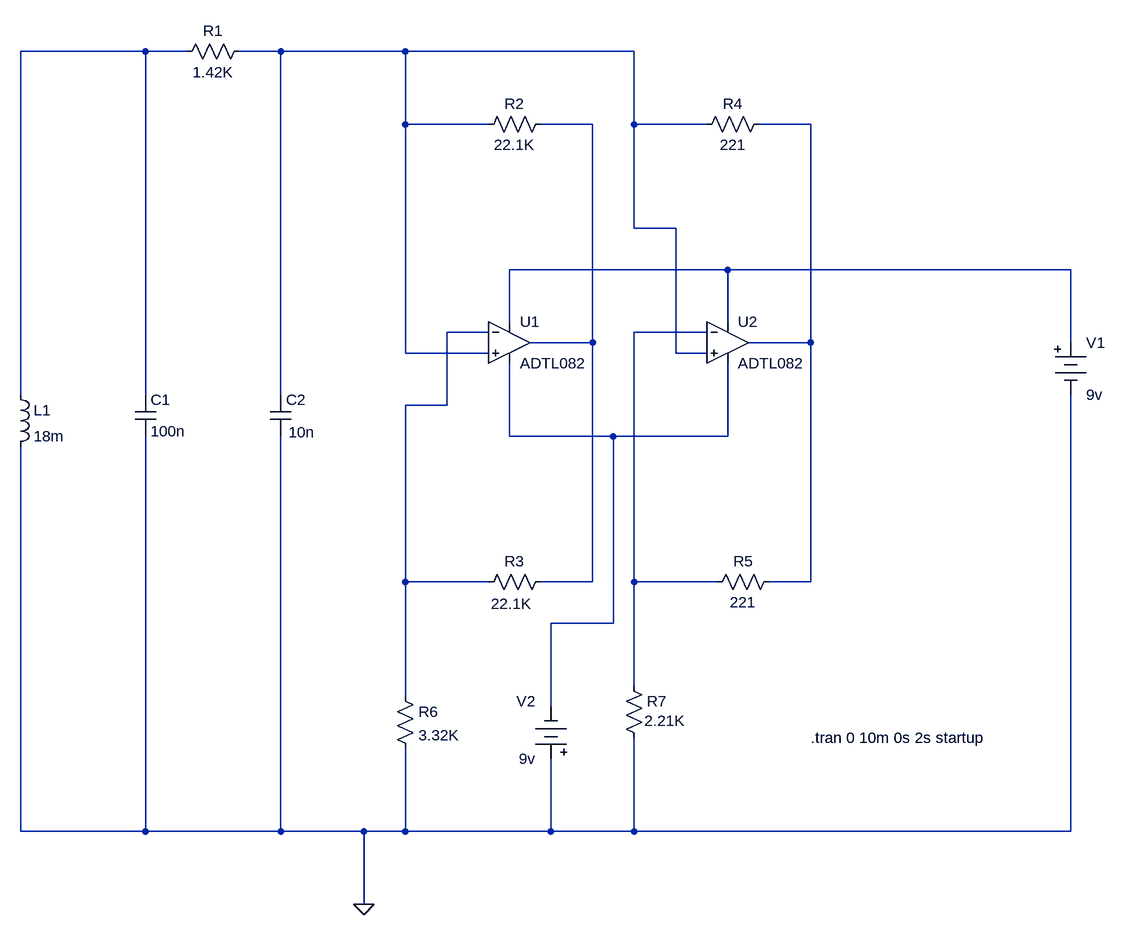
[diagram p0: schematic chuacomplete.asc]
chuacomplete.asc, the LTspice schematic file:
Version 4
SHEET 1 880 680
WIRE -2192 -2160 -2384 -2160
WIRE -2128 -2160 -2192 -2160
WIRE -1984 -2160 -2048 -2160
WIRE -1792 -2160 -1984 -2160
WIRE -1440 -2160 -1792 -2160
WIRE -1792 -2048 -1792 -2160
WIRE -1664 -2048 -1792 -2048
WIRE -1504 -2048 -1584 -2048
WIRE -1440 -2048 -1440 -2160
WIRE -1328 -2048 -1440 -2048
WIRE -1168 -2048 -1248 -2048
WIRE -1440 -1888 -1440 -2048
WIRE -1376 -1888 -1440 -1888
WIRE -1296 -1824 -1632 -1824
WIRE -768 -1824 -1296 -1824
WIRE -1632 -1744 -1632 -1824
WIRE -1296 -1744 -1296 -1824
WIRE -1664 -1728 -1728 -1728
WIRE -1328 -1728 -1440 -1728
WIRE -1504 -1712 -1504 -2048
WIRE -1504 -1712 -1600 -1712
WIRE -1168 -1712 -1168 -2048
WIRE -1168 -1712 -1264 -1712
WIRE -768 -1712 -768 -1824
WIRE -1792 -1696 -1792 -2048
WIRE -1664 -1696 -1792 -1696
WIRE -1376 -1696 -1376 -1888
WIRE -1328 -1696 -1376 -1696
WIRE -2384 -1632 -2384 -2160
WIRE -2192 -1632 -2192 -2160
WIRE -1984 -1632 -1984 -2160
WIRE -1728 -1616 -1728 -1728
WIRE -1728 -1616 -1792 -1616
WIRE -1632 -1568 -1632 -1680
WIRE -1472 -1568 -1632 -1568
WIRE -1296 -1568 -1296 -1680
WIRE -1296 -1568 -1472 -1568
WIRE -1792 -1344 -1792 -1616
WIRE -1664 -1344 -1792 -1344
WIRE -1504 -1344 -1504 -1712
WIRE -1504 -1344 -1584 -1344
WIRE -1440 -1344 -1440 -1728
WIRE -1312 -1344 -1440 -1344
WIRE -1168 -1344 -1168 -1712
WIRE -1168 -1344 -1232 -1344
WIRE -1472 -1280 -1472 -1568
WIRE -1472 -1280 -1568 -1280
WIRE -1440 -1184 -1440 -1344
WIRE -1792 -1168 -1792 -1344
WIRE -1568 -1152 -1568 -1280
WIRE -2384 -960 -2384 -1552
WIRE -2192 -960 -2192 -1568
WIRE -2192 -960 -2384 -960
WIRE -1984 -960 -1984 -1568
WIRE -1984 -960 -2192 -960
WIRE -1856 -960 -1984 -960
WIRE -1792 -960 -1792 -1088
WIRE -1792 -960 -1856 -960
WIRE -1568 -960 -1568 -1072
WIRE -1568 -960 -1792 -960
WIRE -1440 -960 -1440 -1104
WIRE -1440 -960 -1568 -960
WIRE -768 -960 -768 -1632
WIRE -768 -960 -1440 -960
WIRE -1856 -848 -1856 -960
FLAG -1856 -848 0
SYMBOL OpAmps\\ADTL082 -1632 -1776 R0
SYMATTR InstName U1
SYMBOL OpAmps\\ADTL082 -1296 -1776 R0
SYMATTR InstName U2
SYMBOL ind -2400 -1648 R0
SYMATTR InstName L1
SYMATTR Value 18m
SYMATTR SpiceLine Ipk=0.21 Rser=13.072 Rpar=1.6956e+006 Cpar=0
SYMBOL cap -2208 -1632 R0
SYMATTR InstName C1
SYMATTR Value 100n
SYMATTR SpiceLine V=4 Irms=0 Rser=0 Lser=0 mfg="Murata" pn="GRM011R60G103KE01" type="X5R"
SYMBOL cap -2000 -1632 R0
WINDOW 3 28 58 Left 2
SYMATTR Value 10n
SYMATTR InstName C2
SYMATTR SpiceLine V=4 Irms=162m Rser=0.395426 Lser=0 mfg="KEMET" pn="C0402C103K7PAC" type="X5R"
SYMBOL res -2032 -2176 R90
WINDOW 0 0 56 VBottom 2
WINDOW 3 32 56 VTop 2
SYMATTR InstName R1
SYMATTR Value 1.42K
SYMATTR SpiceLine tol=5 pwr=0.1
SYMBOL res -1568 -2064 R90
WINDOW 0 0 56 VBottom 2
WINDOW 3 32 56 VTop 2
SYMATTR InstName R2
SYMATTR Value 22.1K
SYMATTR SpiceLine tol=1 pwr=0.1
SYMBOL res -1568 -1360 R90
WINDOW 0 0 56 VBottom 2
WINDOW 3 34 61 VTop 2
SYMATTR InstName R3
SYMATTR Value 22.1K
SYMATTR SpiceLine tol=1 pwr=0.1
SYMBOL res -1232 -2064 R90
WINDOW 0 0 56 VBottom 2
WINDOW 3 32 56 VTop 2
SYMATTR InstName R4
SYMATTR Value 221
SYMATTR SpiceLine tol=1 pwr=0.1
SYMBOL res -1328 -1328 R270
WINDOW 0 32 56 VTop 2
WINDOW 3 0 56 VBottom 2
SYMATTR InstName R5
SYMATTR Value 221
SYMATTR SpiceLine tol=1 pwr=0.1
SYMBOL res -1808 -1184 R0
SYMATTR InstName R6
SYMATTR Value 3.32K
SYMATTR SpiceLine tol=1 pwr=0.1
SYMBOL res -1456 -1200 R0
WINDOW 3 32 70 Left 2
SYMATTR Value 2.21K
SYMATTR InstName R7
SYMATTR SpiceLine tol=1 pwr=0.1
SYMBOL Misc\\battery -768 -1728 R0
WINDOW 123 0 0 Left 0
WINDOW 39 0 0 Left 0
SYMATTR InstName V1
SYMATTR Value 9v
SYMBOL Misc\\battery -1568 -1056 R180
WINDOW 0 24 104 Left 2
WINDOW 3 24 16 Left 2
WINDOW 123 0 0 Left 0
WINDOW 39 0 0 Left 0
SYMATTR InstName V2
SYMATTR Value 9v
TEXT -1168 -1104 Left 2 !.tran 0 10m 0s 2s startup

The netlist it stands for:
* chuacomplete.asc
XU1 N002 N006 N005 N008 N003 ADTL082  ; pins In+ In- V+ V- OUT
XU2 N002 N007 N005 N008 N004 ADTL082  ; pins In+ In- V+ V- OUT
L1 N001 0 18m Ipk=0.21 Rser=13.072 Rpar=1.6956e+006 Cpar=0
C1 N001 0 100n V=4 Irms=0 Rser=0 Lser=0 mfg="Murata" pn="GRM011R60G103KE01" type="X5R"
C2 N002 0 10n V=4 Irms=162m Rser=0.395426 Lser=0 mfg="KEMET" pn="C0402C103K7PAC" type="X5R"
R1 N002 N001 1.42K tol=5 pwr=0.1
R2 N003 N002 22.1K tol=1 pwr=0.1
R3 N003 N006 22.1K tol=1 pwr=0.1
R4 N004 N002 221 tol=1 pwr=0.1
R5 N007 N004 221 tol=1 pwr=0.1
R6 N006 0 3.32K tol=1 pwr=0.1
R7 N007 0 2.21K tol=1 pwr=0.1
V1 N005 0 9v
V2 0 N008 9v
.tran 0 10m 0s 2s startup
.lib ADI.lib
.backanno
.end